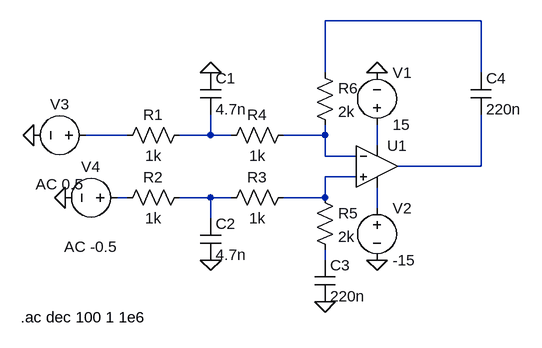
[diagram p0: schematic PLL_loop_filter.asc]
PLL_loop_filter.asc, the LTspice schematic file:
Version 4
SHEET 1 880 680
WIRE 544 -80 304 -80
WIRE 304 0 304 -80
WIRE 544 0 544 -80
WIRE 0 96 -64 96
WIRE 128 96 128 64
WIRE 128 96 80 96
WIRE 160 96 128 96
WIRE 304 96 304 80
WIRE 304 96 240 96
WIRE 384 112 384 80
WIRE 304 128 304 96
WIRE 352 128 304 128
WIRE 544 144 544 64
WIRE 544 144 416 144
WIRE 352 160 304 160
WIRE 0 192 -16 192
WIRE 128 192 80 192
WIRE 160 192 128 192
WIRE 304 192 304 160
WIRE 304 192 240 192
WIRE 384 208 384 176
WIRE 128 224 128 192
WIRE 304 288 304 272
FLAG 128 0 0
FLAG 128 288 0
FLAG 304 352 0
FLAG 384 0 0
FLAG 384 288 0
FLAG -96 192 0
FLAG -144 96 0
SYMBOL res 96 80 R90
WINDOW 0 0 56 VBottom 2
WINDOW 3 32 56 VTop 2
SYMATTR InstName R1
SYMATTR Value 1k
SYMBOL res 96 176 R90
WINDOW 0 0 56 VBottom 2
WINDOW 3 32 56 VTop 2
SYMATTR InstName R2
SYMATTR Value 1k
SYMBOL res 256 176 R90
WINDOW 0 0 56 VBottom 2
WINDOW 3 32 56 VTop 2
SYMATTR InstName R3
SYMATTR Value 1k
SYMBOL res 256 80 R90
WINDOW 0 0 56 VBottom 2
WINDOW 3 32 56 VTop 2
SYMATTR InstName R4
SYMATTR Value 1k
SYMBOL cap 112 0 R0
SYMATTR InstName C1
SYMATTR Value 4.7n
SYMBOL cap 112 224 R0
SYMATTR InstName C2
SYMATTR Value 4.7n
SYMBOL res 288 176 R0
SYMATTR InstName R5
SYMATTR Value 2k
SYMBOL cap 288 288 R0
SYMATTR InstName C3
SYMATTR Value 220n
SYMBOL res 288 -16 R0
SYMATTR InstName R6
SYMATTR Value 2k
SYMBOL cap 528 0 R0
SYMATTR InstName C4
SYMATTR Value 220n
SYMBOL OpAmps\\UniversalOpAmp 384 144 R0
SYMATTR InstName U1
SYMATTR Value2 Avol=1Meg GBW=10000Meg Vos=0
SYMBOL voltage 384 96 M180
WINDOW 0 24 96 Left 2
WINDOW 3 24 16 Left 2
WINDOW 123 0 0 Left 0
WINDOW 39 0 0 Left 0
SYMATTR InstName V1
SYMATTR Value 15
SYMBOL voltage 384 192 R0
WINDOW 123 0 0 Left 0
WINDOW 39 0 0 Left 0
SYMATTR InstName V2
SYMATTR Value -15
SYMBOL voltage -48 96 R90
WINDOW 0 -32 56 VBottom 2
WINDOW 3 32 56 VTop 2
WINDOW 123 60 56 VTop 2
WINDOW 39 0 0 Left 0
SYMATTR InstName V3
SYMATTR Value ""
SYMATTR Value2 AC 0.5
SYMBOL voltage 0 192 R90
WINDOW 0 -32 56 VBottom 2
WINDOW 3 32 56 VTop 2
WINDOW 123 60 56 VTop 2
WINDOW 39 0 0 Left 0
SYMATTR InstName V4
SYMATTR Value ""
SYMATTR Value2 AC -0.5
TEXT -164 376 Left 2 !.ac dec 100 1 1e6

The netlist it stands for:
* PLL_loop_filter.asc
R1 N003 N002 1k
R2 N009 N008 1k
R3 N007 N009 1k
R4 N004 N003 1k
C1 0 N003 4.7n
C2 N009 0 4.7n
R5 N007 N011 2k
C3 N011 0 220n
R6 N001 N004 2k
C4 N001 N006 220n
XU1 N007 N004 N005 N010 N006 level1 Avol=1Meg GBW=10000Meg Vos=0 En=0 Enk=0 In=0 Ink=0 Rin=500Meg  ; pins In+ In- V+ V- OUT
V1 N005 0 15
V2 N010 0 -15
V3 N002 0 AC 0.5
V4 N008 0 AC -0.5
.ac dec 100 1 1e6
.lib UniversalOpAmp1.lib
.backanno
.end